# Altium schematic sheet ICE40IO.SchDoc
size A
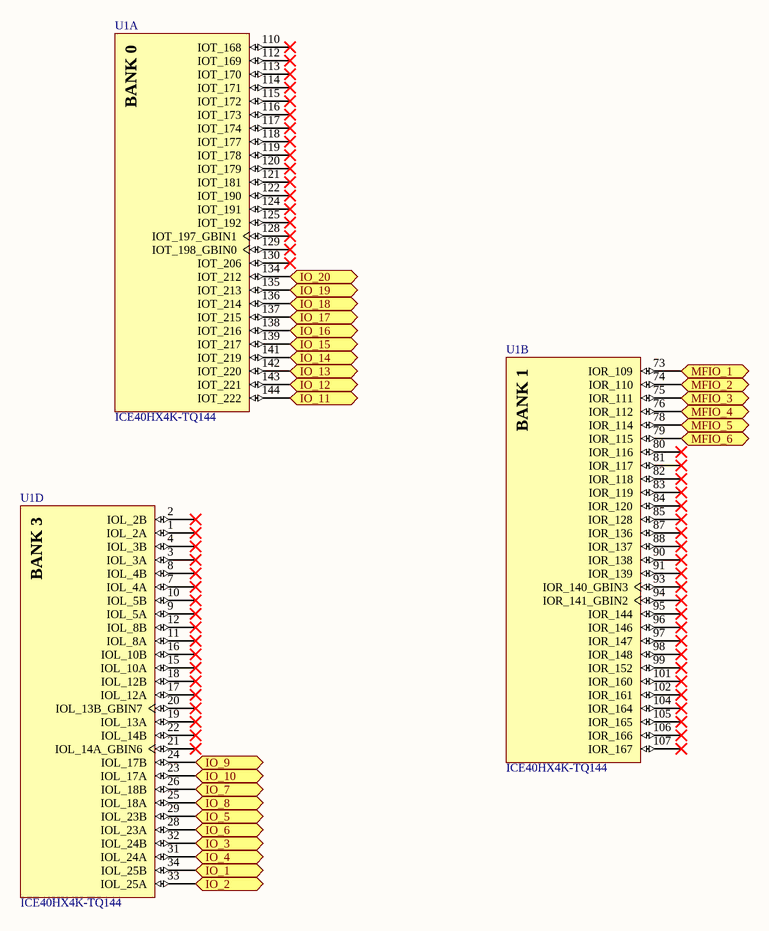
[diagram p0: ICE40IO.SchDoc]

## Parts
U1  ICE40HX4K-TQ144  [LATC-TQFP-144_M]  (parts A,B,D of 5)

## Ports
IO_1 (bidir), IO_2 (bidir), IO_3 (bidir), IO_4 (bidir), IO_5 (bidir), IO_6 (bidir), IO_7 (bidir), IO_8 (bidir), IO_9 (bidir), IO_10 (bidir), IO_11 (bidir), IO_12 (bidir), IO_13 (bidir), IO_14 (bidir), IO_15 (bidir), IO_16 (bidir), IO_17 (bidir), IO_18 (bidir), IO_19 (bidir), IO_20 (bidir), MFIO_1 (bidir), MFIO_2 (bidir), MFIO_3 (bidir), MFIO_4 (bidir), MFIO_5 (bidir), MFIO_6 (bidir)

## Nets
IO_1: U1.34(IOL_25B) ; port IO_1
IO_2: U1.33(IOL_25A) ; port IO_2
IO_3: U1.32(IOL_24B) ; port IO_3
IO_4: U1.31(IOL_24A) ; port IO_4
IO_5: U1.29(IOL_23B) ; port IO_5
IO_6: U1.28(IOL_23A) ; port IO_6
IO_7: U1.26(IOL_18B) ; port IO_7
IO_8: U1.25(IOL_18A) ; port IO_8
IO_9: U1.24(IOL_17B) ; port IO_9
IO_10: U1.23(IOL_17A) ; port IO_10
IO_11: U1.144(IOT_222) ; port IO_11
IO_12: U1.143(IOT_221) ; port IO_12
IO_13: U1.142(IOT_220) ; port IO_13
IO_14: U1.141(IOT_219) ; port IO_14
IO_15: U1.139(IOT_217) ; port IO_15
IO_16: U1.138(IOT_216) ; port IO_16
IO_17: U1.137(IOT_215) ; port IO_17
IO_18: U1.136(IOT_214) ; port IO_18
IO_19: U1.135(IOT_213) ; port IO_19
IO_20: U1.134(IOT_212) ; port IO_20
MFIO_1: U1.73(IOR_109) ; port MFIO_1
MFIO_2: U1.74(IOR_110) ; port MFIO_2
MFIO_3: U1.75(IOR_111) ; port MFIO_3
MFIO_4: U1.76(IOR_112) ; port MFIO_4
MFIO_5: U1.78(IOR_114) ; port MFIO_5
MFIO_6: U1.79(IOR_115) ; port MFIO_6

Not connected (* = marked no-connect by the designer): U1 1(IOL_2A)* 2(IOL_2B)* 3(IOL_3A)* 4(IOL_3B)* 7(IOL_4A)* 8(IOL_4B)* 9(IOL_5A)* 10(IOL_5B)* 11(IOL_8A)* 12(IOL_8B)* 15(IOL_10A)* 16(IOL_10B)* 17(IOL_12A)* 18(IOL_12B)* 19(IOL_13A)* 20(IOL_13B_GBIN7)* 21(IOL_14A_GBIN6)* 22(IOL_14B)* 80(IOR_116)* 81(IOR_117)* 82(IOR_118)* 83(IOR_119)* 84(IOR_120)* 85(IOR_128)* 87(IOR_136)* 88(IOR_137)* 90(IOR_138)* 91(IOR_139)* 93(IOR_140_GBIN3)* 94(IOR_141_GBIN2)* 95(IOR_144)* 96(IOR_146)* 97(IOR_147)* 98(IOR_148)* 99(IOR_152)* 101(IOR_160)* 102(IOR_161)* 104(IOR_164)* 105(IOR_165)* 106(IOR_166)* 107(IOR_167)* 110(IOT_168)* 112(IOT_169)* 113(IOT_170)* 114(IOT_171)* 115(IOT_172)* 116(IOT_173)* 117(IOT_174)* 118(IOT_177)* 119(IOT_178)* 120(IOT_179)* 121(IOT_181)* 122(IOT_190)* 124(IOT_191)* 125(IOT_192)* 128(IOT_197_GBIN1)* 129(IOT_198_GBIN0)* 130(IOT_206)*

## Notes on the sheet
- (in symbol ICE40HX4K-TQ144, part A) BANK 0
- (in symbol ICE40HX4K-TQ144, part B) BANK 1
- (in symbol ICE40HX4K-TQ144, part D) BANK 3

## Library data of the parts
U1 = ICE40HX4K-TQ144: iCE40 HX4K Series FPGA Family, 3520 Logic Cells, 1.2 V Core, 80 K Embedded RAM Bits, 144-pin TQFP, Pb-Free, Tray; Manufacturer: Lattice Semiconductor; Embedded RAM Bits: 80K; Logic Cells: 3520; Phase-Locked Loops: 2; Supply Voltage: 1.2V; DatasheetVersion: Rev. 02.9; PackageVersion: Rev. 03.9, 02/2013; PackageReference: TQFP-144; PackageDescription: 144-Pin Thin Quad Flat Package, Body 20 x 20 mm, Pitch 0.5 mm; Supplier 1: Digi-Key; Supplier Part Number 1: 220-1572-ND; Supplier 2: Mouser; Supplier Part Number 2: 842-ICE40HX4K-TQ144; Packing: Tray; RoHS: TRUE; Mounting Technology: Surface Mount; PartNumber: ICE40HX4K-TQ144; ComponentLink1Description: Manufacturer URL; ComponentLink1URL: http://www.latticesemi.com/en; ComponentLink2Description: Datasheet; ComponentLink2URL: http://www.latticesemi.com/~/media/Documents/DataSheets/iCE/iCE40LPHXFamilyDataSheet.pdf; ComponentLink3Description: Package Specification; ComponentLink3URL: http://www.latticesemi.com/lit/docs/package/pkg.pdf